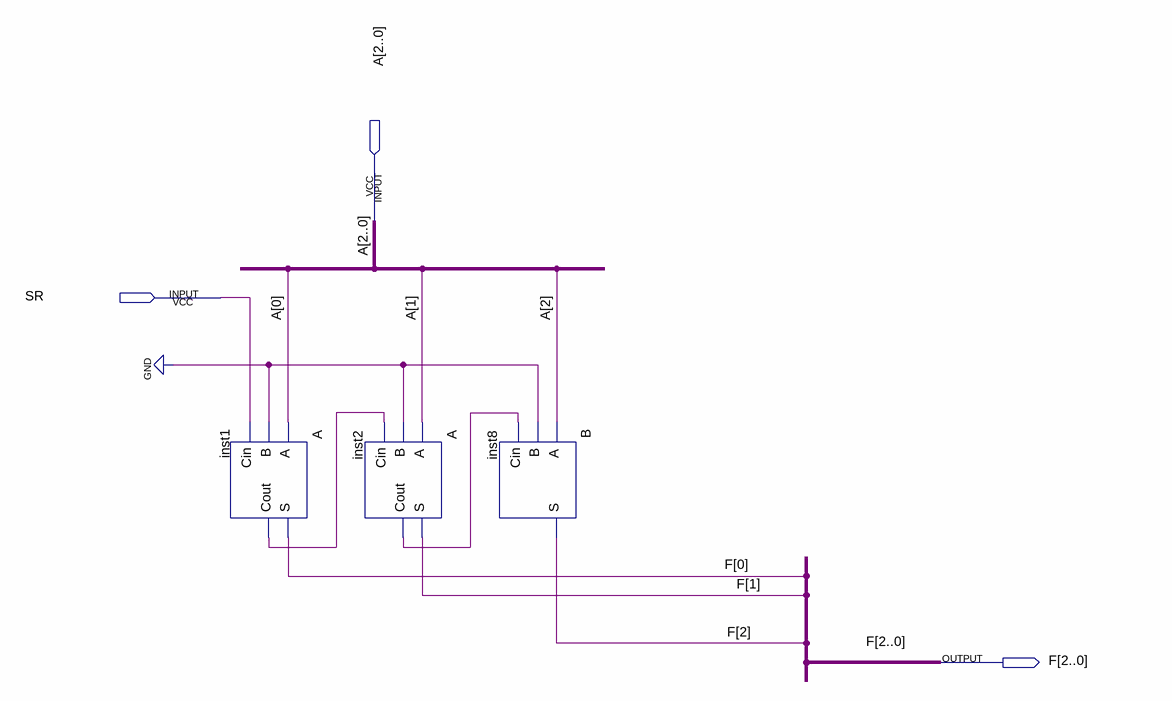
[diagram p0: schematic sheet]
// Quartus schematic Cong1_4bit.bdf as structural Verilog: 3 symbols, 3 pins
module Cong1_4bit (
  input  [2:0] A,
  input  SR,
  output [2:0] F
);

  wire inst1_cout, inst2_cout;

  A inst1 (.A(A[0]), .B(1'b0), .Cin(SR), .S(F[0]), .Cout(inst1_cout));
  A inst2 (.A(A[1]), .B(1'b0), .Cin(inst1_cout), .S(F[1]), .Cout(inst2_cout));
  B inst8 (.A(A[2]), .B(1'b0), .Cin(inst2_cout), .S(F[2]));
endmodule
